# EasyEDA schematic Pc z80_senza arduino.json
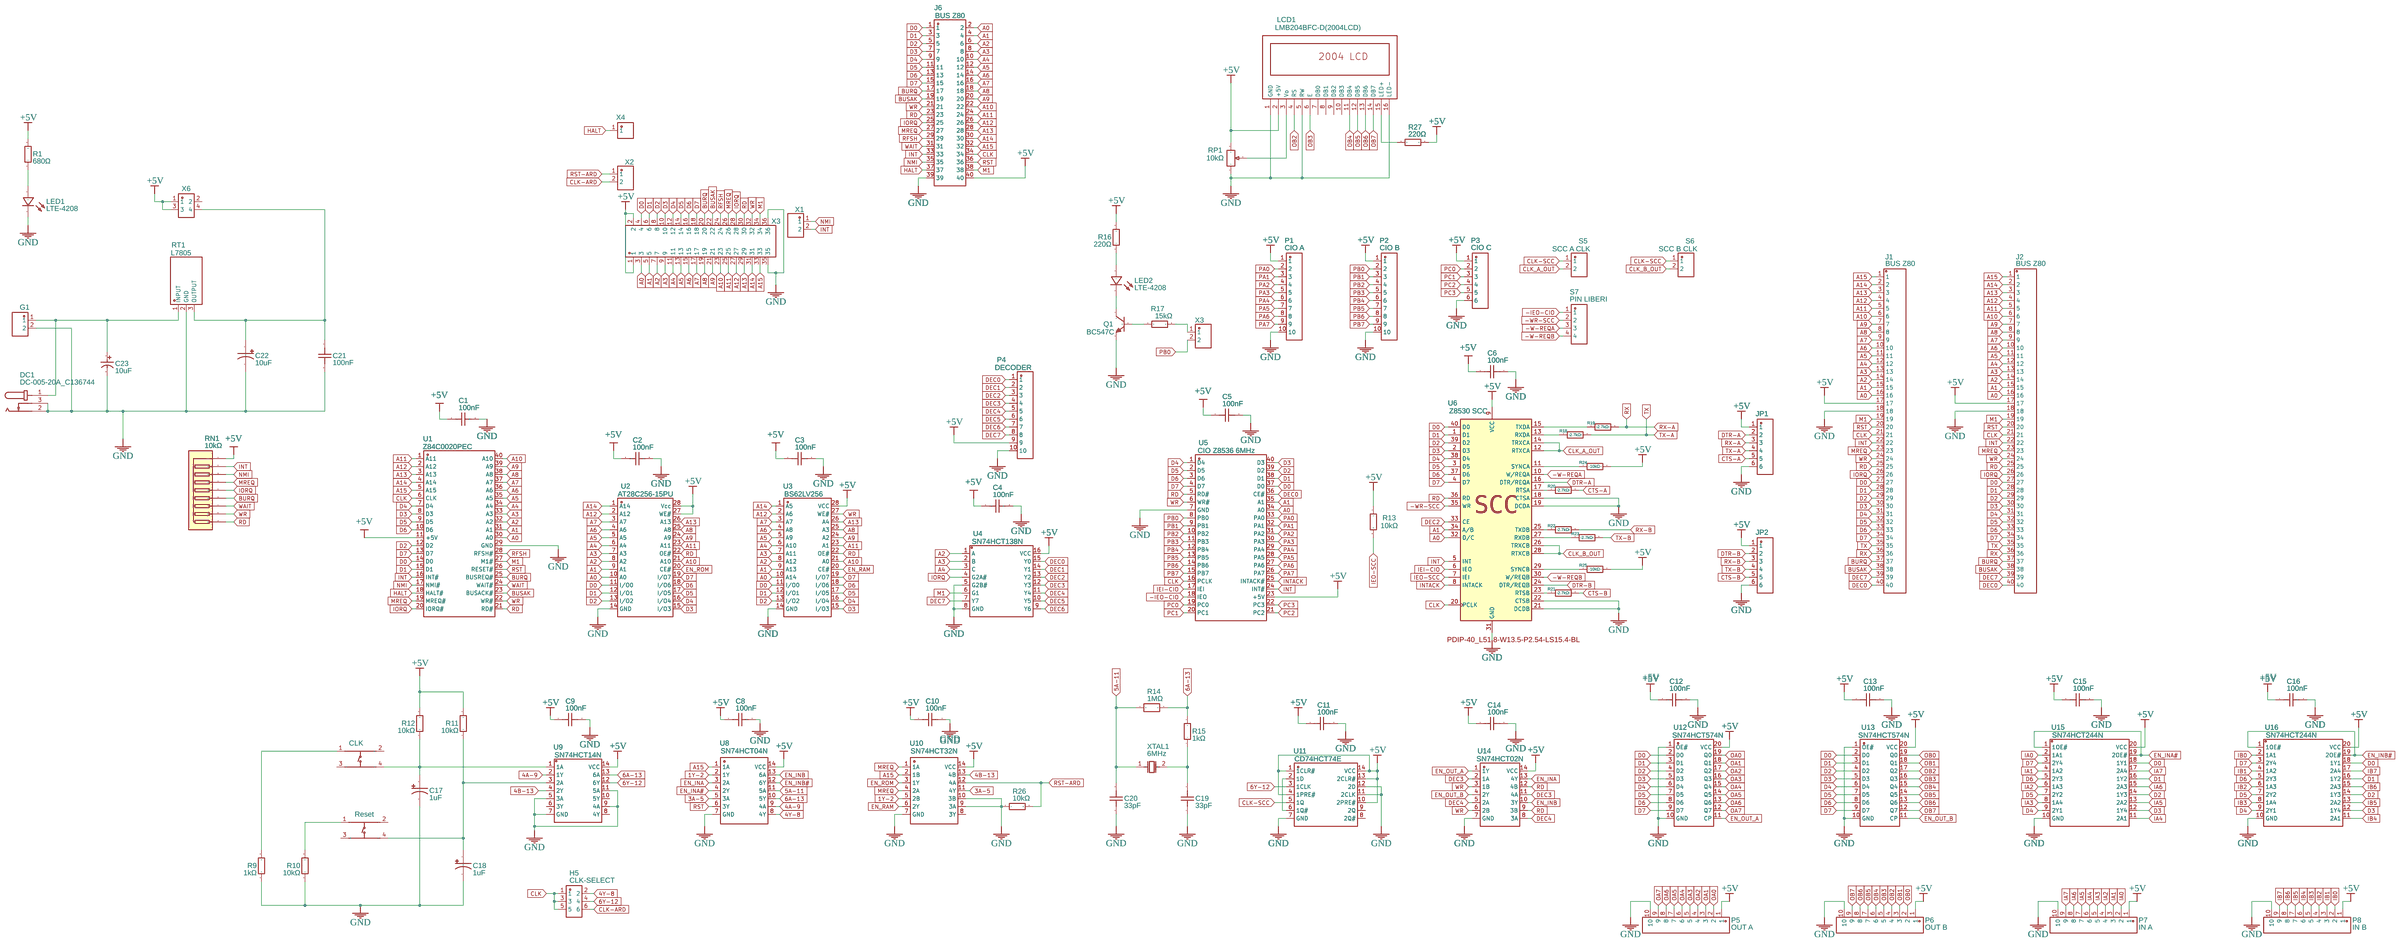
[diagram p0: schematic sheet]

## Parts
C1  100nF  [CAP-TH_L7.5-W2.5-P5.00-D0.5]
C2  100nF  [CAP-TH_L7.5-W2.5-P5.00-D0.5]
C3  100nF  [CAP-TH_L7.5-W2.5-P5.00-D0.5]
C4  100nF  [CAP-TH_L7.5-W2.5-P5.00-D0.5]
C5  100nF  [CAP-TH_L7.5-W2.5-P5.00-D0.5]
C6  100nF  [CAP-TH_L7.5-W2.5-P5.00-D0.5]
C8  100nF  [CAP-TH_L7.5-W2.5-P5.00-D0.5]
C9  100nF  [CAP-TH_L7.5-W2.5-P5.00-D0.5]
C10  100nF  [CAP-TH_L7.5-W2.5-P5.00-D0.5]
C11  100nF  [CAP-TH_L7.5-W2.5-P5.00-D0.5]
C12  100nF  [CAP-TH_L7.5-W2.5-P5.00-D0.5]
C13  100nF  [CAP-TH_L7.5-W2.5-P5.00-D0.5]
C14  100nF  [CAP-TH_L7.5-W2.5-P5.00-D0.5]
C15  100nF  [CAP-TH_L7.5-W2.5-P5.00-D0.5]
C16  100nF  [CAP-TH_L7.5-W2.5-P5.00-D0.5]
C17  1uF  [CAP-TH_BD5.0-P2.00-D0.8-FD]
C18  1uF  [CAP-TH_BD5.0-P2.00-D0.8-FD]
C19  33pF  [RCL-TH_L4.0-W2.6-LS2.5]
C20  33pF  [RCL-TH_L4.0-W2.6-LS2.5]
C21  100nF  [CAP-TH_L7.5-W2.5-P5.00-D0.5]
C22  10uF  [CAP-TH_BD4.0-P1.50-D0.5-FD]
C23  10uF  [CAP-TH_BD5.0-P2.00-D0.8-FD]
DC1  DC-005-20A_C136744  [DC-IN-TH_DC-005-20A]
H2  X3  [HDR-TH_36P-P2.54-V-M-R2-C18-S2.54]
H3  X1  [HDR-TH_2P-P2.54-V-M]
H4  X2  [HDR-TH_2P-P2.54-V-M]
H5  CLK-SELECT  [HDR-TH_6P-P2.54-V-M-R2-C3-S2.54]
H6  X3  [HDR-TH_2P-P2.54-V-M]
H7  JP1  [HDR-TH_6P-P2.54-V-F]
H8  JP2  [HDR-TH_6P-P2.54-V-F]
J1  BUS Z80  [HDR-TH_40P-P2.54-V-F]
J2  BUS Z80  [HDR-TH_40P-P2.54-V-F]
J6  BUS Z80  [HDR-TH_40P-P2.54-V-M-R2-C20-S2.54]
LCD1  LMB204BFC-D(2004LCD)  [LCD2004]
LED1  LTE-4208  [LED-TH_BD5.8-P2.54-FD]
LED2  LTE-4208  [LED-TH_BD5.8-P2.54-FD]
P1  CIO A  [HDR-TH_10P-P2.54-V-F]
P2  CIO B  [HDR-TH_10P-P2.54-V-F]
P3  CIO C  [HDR-TH_6P-P2.54-V-F]
P4  DECODER  [HDR-TH_10P-P2.54-V-F]
P5  OUT A  [HDR-TH_10P-P2.54-V-F]
P6  OUT B  [HDR-TH_10P-P2.54-V-F]
P7  IN A  [HDR-TH_10P-P2.54-V-F]
P8  IN B  [HDR-TH_10P-P2.54-V-F]
Q1  BC547C  [TO-92-3_L4.9-W3.7-P1.27-L]
R1  680Ω  [RES-TH_BD2.2-L6.5-P10.50-D0.6]
R9  1kΩ  [RES-TH_BD2.3-L6.5-P10.50-D0.5]
R10  10kΩ  [RES-TH_BD2.3-L6.5-P10.50-D0.5]
R11  10kΩ  [RES-TH_BD2.3-L6.5-P10.50-D0.5]
R12  10kΩ  [RES-TH_BD2.3-L6.5-P10.50-D0.5]
R13  10kΩ  [RES-TH_BD2.3-L6.5-P10.50-D0.5]
R14  1MΩ  [RES-TH_BD2.7-L6.2-P10.20-D0.4]
R15  1kΩ  [RES-TH_BD2.5-L6.5-P10.50-D0.6]
R16  220Ω  [RES-TH_BD2.3-L6.5-P10.50-D0.5]
R17  15kΩ  [RES-TH_BD2.3-L6.5-P10.50-D0.5]
R18  2.7kΩ  [RES-TH_BD2.3-L6.5-P10.50-D0.5]
R19  2.7kΩ  [RES-TH_BD2.3-L6.5-P10.50-D0.5]
R20  2.7kΩ  [RES-TH_BD2.3-L6.5-P10.50-D0.5]
R21  2.7kΩ  [RES-TH_BD2.3-L6.5-P10.50-D0.5]
R22  2.7kΩ  [RES-TH_BD2.3-L6.5-P10.50-D0.5]
R23  2.7kΩ  [RES-TH_BD2.3-L6.5-P10.50-D0.5]
R24  10kΩ  [RES-TH_BD2.3-L6.5-P10.50-D0.5]
R25  10kΩ  [RES-TH_BD2.3-L6.5-P10.50-D0.5]
R26  10kΩ  [RES-TH_BD2.5-L6.5-P10.50-D0.6]
R27  220Ω  [RES-TH_BD2.7-L6.2-P10.20-D0.4]
RN1  10kΩ  [RES-ARRAY-TH_9P-P2.54-D1.0]
RP1  10kΩ  [RES-ADJ-TH_3P-L7.1-W6.9-P2.50-L_3362P]
RT1  L7805  [TO-220-3_L10.0-W4.5-P2.54-L]
S5  SCC A CLK  [HDR-TH_2P-P2.54-V-F]
S6  SCC B CLK  [HDR-TH_2P-P2.54-V-F]
S7  PIN LIBERI  [HDR-TH_4P-P2.54-V-F]
SW1  Reset  [SW-TH_4P-L6.0-W6.0-P4.50-LS6.5]
SW4  CLK  [SW-TH_4P-L6.0-W6.0-P4.50-LS6.5]
U1  Z84C0020PEC  [PDIP-40_L52.3-W13.7-P2.54-LS15.5-BL]
U2  AT28C256-15PU  [PDIP-28_L37.0-W13.5-P2.54-LS15.6-BL]
U3  BS62LV256  [CDIP-28_L37.8-W15.4-P2.54-LS15.2-BL]
U4  SN74HCT138N  [DIP-16_L19.2-W6.6-P2.54-LS7.6-BL]
U5  CIO Z8536 6MHz  [PDIP-40_L52.3-W13.8-P2.54-LS15.2-BL]
U6  Z8530 SCC  [PDIP-40_L51.8-W13.5-P2.54-LS15.4-BL]
U8  SN74HCT04N  [PDIP-14_L19.3-W6.4-P2.54-LS7.9-BL-1]
U9  SN74HCT14N  [PDIP-14_L19.7-W6.6-P2.54-LS8.3-BL]
U10  SN74HCT32N  [PDIP-14_L19.3-W6.4-P2.54-LS8.0-BL]
U11  CD74HCT74E  [PDIP-14_L19.7-W6.6-P2.54-LS8.3-BL]
U12  SN74HCT574N  [PDIP-20_L25.9-W6.6-P2.54-LS7.9-BL]
U13  SN74HCT574N  [PDIP-20_L25.9-W6.6-P2.54-LS7.9-BL]
U14  SN74HCT02N  [DIP-14_L19.6-W6.4-P2.54-LS7.6-BL]
U15  SN74HCT244N  [DIP-20_L25.5-W10.0-P2.54-LS7.6-BL]
U16  SN74HCT244N  [DIP-20_L25.5-W10.0-P2.54-LS7.6-BL]
X4  X4  [HDR-TH_1P-V-F-1]
X5  G1  [HDR-TH_2P-P2.54-V-M]
X6  X6  [HDR-TH_4P-P2.54-V-M-R2-C2-S2.54]
XTAL1  6MHz  [HC-49US_L11.0-W4.6-P4.88]

## Library data of the parts
C1-C6 C8-C16 C21 = 82CL0113: Supplier: LCSC; Supplier Part: C5359294; Manufacturer: KNSCHA(科尼盛); Contributor: lcsc
C17 C18 = RC050M1R0LO5*11TH-2A1E: Contributor: LCSC; Supplier: LCSC; Supplier Part: C357595; Manufacturer: BERYL(绿宝石); JLCPCB Part Class: Extended Part
C19 C20 = K330J15C0GF5TL2: Supplier: LCSC; Supplier Part: C2170185; Manufacturer: VISHAY(威世); Contributor: lcsc; JLCPCB Part Class: Extended Part
C22 = 6.3MS510MEFCTZ4X5: Contributor: lcsc; Supplier: LCSC; Supplier Part: C5115397; Manufacturer: rubycon(红宝石); JLCPCB Part Class: Extended Part
C23 = 10uF 16V 5*11: Supplier: LCSC; Manufacturer: CX(承兴); Manufacturer Part: KM106M016D11RR0VH2FP0; Supplier Part: C43799; JLCPCB Part Class: Extended Part
DC1 = DC-005-20A_C136744: Contributor: LCSC; Supplier: LCSC; Manufacturer: 韩国韩荣; Manufacturer Part: DC-005-20A; Supplier Part: C136744; JLCPCB Part Class: Extended Part
H2 = PZ254-2-18-Z-8.5: Contributor: LCSC; Supplier: LCSC; Supplier Part: C2894979; Manufacturer: HCTL(华灿天禄); JLCPCB Part Class: Extended Part
H3 H4 H6 = PZ254V-11-02P: Contributor: LCSC; Supplier: LCSC; Supplier Part: C492401; Manufacturer: XFCN(兴飞); JLCPCB Part Class: Extended Part
H5 = PZ254V-12-6P: Contributor: LCSC; Supplier: LCSC; Supplier Part: C492420; Manufacturer: XFCN(兴飞); JLCPCB Part Class: Extended Part
H7 H8 = PM254V-11-06-H85: Contributor: LCSC; Supplier: LCSC; Supplier Part: C2832269; Manufacturer: XFCN(兴飞); JLCPCB Part Class: Extended Part
J1 J2 = 2.54MM1*40HEIGHT5.7MM: Contributor: LCSC; Supplier: LCSC; Manufacturer: BOOMELE(博穆精密); Manufacturer Part: 2.54-1*40P母高5.7; Supplier Part: C47940; JLCPCB Part Class: Extended Part
J6 = PZ2.54-2*20: Supplier: LCSC; Supplier Part: C5224014; Manufacturer: ZHOURI(洲日); JLCPCB Part Class: Extended Part; Contributor: lcsc
LCD1 = LMB204BFC-D(2004LCD): Manufacturer: TOPWAY; link: https://www.devicemart.co.kr/goods/view?no=19049; Contributor: edsonwoodworking
LED1 LED2 = LTE-4208: Supplier: LCSC; Supplier Part: C5346733; Manufacturer: LITEON(光宝); JLCPCB Part Class: Extended Part; Contributor: lcsc
P1 P2 P4-P8 = PM2.54-1*10: Contributor: lcsc; Supplier: LCSC; Supplier Part: C5116489; Manufacturer: ZHOURI(洲日); JLCPCB Part Class: Extended Part
P3 = Header-Female-2.54_1x6: Supplier: LCSC; Manufacturer: BOOMELE(博穆精密); Manufacturer Part: 2.54-1*6P母; Supplier Part: C40877; JLCPCB Part Class: Extended Part
Q1 = BC547C: Contributor: LCSC; Supplier: LCSC; Supplier Part: C713614; Manufacturer: LGE(鲁光); JLCPCB Part Class: Extended Part
R1 = CF1/4W-680Ω±5% T52: Supplier: LCSC; Manufacturer: CCO(千志电子); Manufacturer Part: CF1/4W-680Ω±5% T; Supplier Part: C120051; JLCPCB Part Class: Extended Part
R9-R13 R16-R25 = CF1/4W-1KΩ±5% T52: Contributor: LCSC; Supplier: LCSC; Supplier Part: C120055; Manufacturer: CCO(千志电子); Manufacturer Part: CF1/4W-1KΩ±5% T; JLCPCB Part Class: Extended Part
R14 = MF1/4W-1M±1%-OT52: Contributor: lcsc; Supplier: LCSC; Supplier Part: C2903250; Manufacturer: VO(翔胜); JLCPCB Part Class: Extended Part
R15 = MO1/2WS-220K±5%-ST52: Contributor: LCSC; Supplier: LCSC; Supplier Part: C479385; Manufacturer: VO(翔胜); JLCPCB Part Class: Extended Part; link: https://lcsc.com/eda_search?q=C479385&%26type=1&ref=editor
R26 = MO1/2WS-220K±5%-ST52: Contributor: LCSC; Supplier: LCSC; Supplier Part: C479385; Manufacturer: VO(翔胜); JLCPCB Part Class: Extended Part
R27 = MF1/4W-100K±1%-OT26: Contributor: lcsc; Supplier: LCSC; Supplier Part: C2843019; Manufacturer: VO(翔胜); JLCPCB Part Class: Extended Part
RN1 = A09-103JP: Supplier: LCSC; Manufacturer: FH(风华); Supplier Part: C8692; JLCPCB Part Class: Extended Part
RP1 = 3362P-1-202_C118929: Resistance(Ohms): 2K; Contributor: LCSC; Supplier: LCSC; Supplier Part: C118929; Manufacturer: BOCHEN(博晨); Manufacturer Part: 3362P-1-202; JLCPCB Part Class: Extended Part
RT1 = L7805_C22378639: Supplier: LCSC; Supplier Part: C22378639; Manufacturer: OSEN(欧芯); JLCPCB Part Class: Extended Part; Contributor: lcsc
S5 S6 = ZX-PM2.54-1-2PY: Supplier: LCSC; Supplier Part: C7499322; Manufacturer: Megastar(兆星); Contributor: lcsc; JLCPCB Part Class: Extended Part
S7 = 2.54-1*4P母: Contributor: LCSC; Supplier: LCSC; Supplier Part: C2718488; Manufacturer: BOOMELE(博穆精密); JLCPCB Part Class: Extended Part
SW1 SW4 = TS665CJ: Contributor: LCSC; Supplier: LCSC; Supplier Part: C393938; Manufacturer: SHOU HAN(首韩); JLCPCB Part Class: Extended Part
U1 = Z84C0008PEG: Supplier: LCSC; Supplier Part: C3231800; Manufacturer: Zilog; JLCPCB Part Class: Extended Part; Contributor: lcsc
U2 = AT28C256-15PU: Contributor: LCSC; Supplier: LCSC; Supplier Part: C1348752; Manufacturer: MICROCHIP(美国微芯); JLCPCB Part Class: Extended Part
U3 = CY62256NL-70PC: Contributor: lcsc; Supplier: LCSC; Supplier Part: C2956434; Manufacturer: Infineon/CYPRESS(赛普拉斯); JLCPCB Part Class: Extended Part
U4 = SN74HCT138N: Contributor: LCSC; Supplier: LCSC; Supplier Part: C67461; Manufacturer: TI(德州仪器); JLCPCB Part Class: Extended Part
U5 = Z0853606PSG: Contributor: LCSC; Supplier: LCSC; Supplier Part: C2614526; Manufacturer: Zilog; JLCPCB Part Class: Extended Part
U6 = Z8530-RESCUE-SERIALIO: Contributor: ZORAk; Package Display: Yes
U8 = SN74HCT04N: Contributor: LCSC; Supplier: LCSC; Manufacturer: TI(德州仪器); Supplier Part: C50939; JLCPCB Part Class: Extended Part
U9 = SN74HCT14N: Contributor: LCSC; Supplier: LCSC; Supplier Part: C352959; Manufacturer: TI(德州仪器); JLCPCB Part Class: Extended Part
U10 = SN74HCT32N: Contributor: LCSC; Supplier: LCSC; Supplier Part: C2869289; Manufacturer: TI(德州仪器); JLCPCB Part Class: Extended Part
U11 = CD74HCT74E: Contributor: LCSC; Supplier: LCSC; Supplier Part: C1523192; Manufacturer: TI(德州仪器); JLCPCB Part Class: Extended Part
U12 U13 = SN74HCT574N: Contributor: LCSC; Supplier: LCSC; Supplier Part: C1523201; Manufacturer: TI(德州仪器); JLCPCB Part Class: Extended Part
U14 = SN74HCT02N: Supplier: LCSC; Supplier Part: C354417; Manufacturer: TI(德州仪器); JLCPCB Part Class: Extended Part; Contributor: lcsc
U15 U16 = SN74HCT244N: Contributor: LCSC; Supplier: LCSC; Supplier Part: C347587; Manufacturer: TI(德州仪器); JLCPCB Part Class: Extended Part
X4 = X5511FV-01-C30D97-0970: Contributor: LCSC; Supplier: LCSC; Supplier Part: C2883469; Manufacturer: XKB Connectivity(中国星坤); JLCPCB Part Class: Extended Part
X5 = ZX-PZ2.54-1-2PZZ: Supplier: LCSC; Supplier Part: C7501260; Manufacturer: Megastar(兆星); Contributor: lcsc; JLCPCB Part Class: Extended Part
X6 = PZ254V-12-4P: Contributor: LCSC; Supplier: LCSC; Supplier Part: C492419; Manufacturer: XFCN(兴飞); JLCPCB Part Class: Extended Part
XTAL1 = ECS-60-32-4X: Contributor: lcsc; Supplier: LCSC; Supplier Part: C2636154; Manufacturer: ECS

## Nets
+5V: C1.1 C2.1 C3.1 C4.1 C5.1 C6.1 C8.1 C9.1 C10.1 C11.1 C12.1 C13.1 C14.1 C15.1 C16.1 H2.1 H2.2 H7.1 H8.1 J1.17 J2.17 J6.40 LCD1.2(+5V) P1.1 P2.1 P3.1 P4.9 P5.1 P6.1 P7.1 P8.1 R1.2 R11.2 R12.2 R13.1 R16.2 R24.2 R25.2 R27.2 RN1.1 RP1.3 U1.11(+5V) U2.27(WE#) U2.28(Vcc) U3.28(VCC) U4.16(VCC) U5.23(+5V) U6.9(VCC) U8.14(VCC) U9.14(VCC) U10.14(VCC) U11.1(1CLR#) U11.4(1PRE#) U11.10(2PRE#) U11.13(2CLR#) U11.14(VCC) U12.20(VCC) U13.20(VCC) U14.14(VCC) U15.20(VCC) U16.20(VCC) X6.1 X6.3
GND: C1.2 C2.2 C3.2 C4.2 C5.2 C6.2 C8.2 C9.2 C10.2 C11.2 C12.2 C13.2 C14.2 C15.2 C16.2 C17.2 C18.2 C19.1 C20.1 C21.2 C22.2 C23.2 DC1.2 DC1.3 H2.35 H2.36 H7.6 H8.6 J1.18 J2.18 J6.39 LCD1.1(GND) LCD1.5(RW) LCD1.16(LED-) LED1.2 P1.10 P2.10 P3.6 P4.10 P5.10 P6.10 P7.10 P8.10 Q1.3(E) R9.1 R10.1 R26.1 RP1.1 RT1.2(GND) U1.29(GND) U2.14(GND) U3.14(GND) U4.5(G2B#) U4.8(GND) U5.7(GND) U6.18(CTSA) U6.19(DCDA) U6.21(DCDB) U6.22(CTSB) U6.31(GND) U8.7(GND) U9.5(3A) U9.7(GND) U9.9(4A) U9.11(5A) U10.7(GND) U10.9(3A) U10.10(3B) U11.7(GND) U11.11(2CLK) U11.12(2D) U12.1(OE#) U12.10(GND) U13.1(OE#) U13.10(GND) U14.7(GND) U15.10(GND) U16.10(GND) X5.2
1Y-2: U8.2(1Y) U10.5(2B)
3A-5: U8.5(3A) U10.11(4Y)
4A-9: U8.9(4A) U9.2(1Y)
4B-13: U9.4(2Y) U10.13(4B)
4Y-8: H5.2 U8.8(4Y)
5A-11: C20.2 R14.1 U8.11(5A) XTAL1.1(OSC1)
6A-13: R14.2 R15.2 U8.10(5Y) U9.13(6A)
6Y-12: H5.4 U9.12(6Y) U11.3(1CLK)
-IEO-CIO: S7.1 U5.18(IEO)
-W-REQA: S7.3 U6.10(W/REQA)
-W-REQB: S7.4 U6.30(W/REQB)
-WR-SCC: S7.2 U6.35(WR)
A0: H2.3 J1.16 J2.16 J6.2 U1.30(A0) U2.10(A0) U3.10(A14) U5.34(A0) U6.32(D/C)
A1: H2.5 J1.15 J2.15 J6.4 U1.31(A1) U2.9(A1) U3.9(A13) U5.35(A1) U6.34(A/B)
A2: H2.7 J1.14 J2.14 J6.6 U1.32(A2) U2.8(A2) U3.8(A12) U4.1(A)
A3: H2.9 J1.13 J2.13 J6.8 U1.33(A3) U2.7(A3) U3.7(A11) U4.2(B)
A4: H2.11 J1.12 J2.12 J6.10 U1.34(A4) U2.6(A4) U3.6(A10) U4.3(C)
A5: H2.13 J1.11 J2.11 J6.12 U1.35(A5) U2.5(A5) U3.5(A9)
A6: H2.15 J1.10 J2.10 J6.14 U1.36(A6) U2.4(A6) U3.4(A8)
A7: H2.17 J1.9 J2.9 J6.16 U1.37(A7) U2.3(A7) U3.3(A7)
A8: H2.19 J1.8 J2.8 J6.18 U1.38(A8) U2.25(A8) U3.25(A3)
A9: H2.21 J1.7 J2.7 J6.20 U1.39(A9) U2.24(A9) U3.24(A2)
A10: H2.23 J1.6 J2.6 J6.22 U1.40(A10) U2.21(A10) U3.21(A0)
A11: H2.25 J1.5 J2.5 J6.24 U1.1(A11) U2.23(A11) U3.23(A1)
A12: H2.27 J1.4 J2.4 J6.26 U1.2(A12) U2.2(A12) U3.2(A6)
A13: H2.29 J1.3 J2.3 J6.28 U1.3(A13) U2.26(A13) U3.26(A4)
A14: H2.31 J1.2 J2.2 J6.30 U1.4(A14) U2.1(A14) U3.1(A5)
A15: H2.33 J1.1 J2.1 J6.32 U1.5(A15) U8.1(1A) U10.2(1B)
BURQ: H2.20 J1.37 J2.37 J6.17 RN1.6 U1.25(BUSREQ#)
BUSAK: H2.22 J1.38 J2.38 J6.19 U1.23(BUSACK#)
CLK: H5.1 H5.3 H5.5 J1.21 J2.21 J6.34 U1.6(CLK) U5.16(PCLK) U6.20(PCLK)
CLK-ARD: H4.2 H5.6
CLK-SCC: S5.1 S6.1 U11.5(1Q)
CLK_A_OUT: S5.2 U6.12(RTXCA) U6.14(TRXCA)
CLK_B_OUT: S6.2 U6.26(TRXCB) U6.28(RTXCB)
CTS-A: H7.5 R20.2
CTS-B: H8.5 R21.2
D0: H2.4 J1.27 J2.27 J6.1 U1.14(D0) U2.11(I/O0) U3.11(I/O0) U5.37(D0) U6.40(D0) U12.2(D0) U13.2(D0) U15.18(1Y1) U16.18(1Y1)
D1: H2.6 J1.28 J2.28 J6.3 U1.15(D1) U2.12(I/O1) U3.12(I/O1) U5.38(D1) U6.1(D1) U12.3(D1) U13.3(D1) U15.16(1Y2) U16.16(1Y2)
D2: H2.8 J1.29 J2.29 J6.5 U1.12(D2) U2.13(I/O2) U3.13(I/O2) U5.39(D2) U6.39(D2) U12.4(D2) U13.4(D2) U15.14(1Y3) U16.14(1Y3)
D3: H2.10 J1.30 J2.30 J6.7 U1.8(D3) U2.15(I/O3) U3.15(I/O3) U5.40(D3) U6.2(D3) U12.5(D3) U13.5(D3) U15.12(1Y4) U16.12(1Y4)
D4: H2.12 J1.31 J2.31 J6.9 U1.7(D4) U2.16(I/O4) U3.16(I/O4) U5.1(D4) U6.38(D4) U12.6(D4) U13.6(D4) U15.9(2Y1) U16.9(2Y1)
D5: H2.14 J1.32 J2.32 J6.11 U1.9(D5) U2.17(I/O5) U3.17(I/O5) U5.2(D5) U6.3(D5) U12.7(D5) U13.7(D5) U15.7(2Y2) U16.7(2Y2)
D6: H2.16 J1.33 J2.33 J6.13 U1.10(D6) U2.18(I/O6) U3.18(I/O6) U5.3(D6) U6.37(D6) U12.8(D6) U13.8(D6) U15.5(2Y3) U16.5(2Y3)
D7: H2.18 J1.34 J2.34 J6.15 U1.13(D7) U2.19(I/O7) U3.19(I/O7) U5.4(D7) U6.4(D7) U12.9(D7) U13.9(D7) U15.3(2Y4) U16.3(2Y4)
DEC0: J1.40 J2.40 P4.1 U4.15(Y0) U5.36(CE#)
DEC1: P4.2 U4.14(Y1)
DEC2: P4.3 U4.13(Y2) U6.33(CE)
DEC3: P4.4 U4.12(Y3) U14.2(1A) U14.11(4A)
DEC4: P4.5 U4.11(Y4) U14.5(2A) U14.8(3A)
DEC5: P4.6 U4.10(Y5)
DEC6: P4.7 U4.9(Y6)
DEC7: J1.39 J2.39 P4.8 U4.7(Y7)
DTR-A: H7.2 U6.16(DTR/REQA)
DTR-B: H8.2 U6.24(DTR/REQB)
EN_INA: U8.3(2A) U14.13(4Y)
EN_INA#: U8.4(2Y) U15.1(1OE#) U15.19(2OE#)
EN_INB: U8.13(6A) U14.10(3Y)
EN_INB#: U8.12(6Y) U16.1(1OE#) U16.19(2OE#)
EN_OUT_A: U12.11(CP) U14.1(1Y)
EN_OUT_B: U13.11(CP) U14.4(2Y)
EN_RAM: U3.20(CE#) U10.6(2Y)
EN_ROM: U2.20(CE#) U10.3(1Y)
HALT: J6.37 U1.18(HALT#) X4.1
IA0: P7.2 U15.2(1A1)
IA1: P7.3 U15.4(1A2)
IA2: P7.4 U15.6(1A3)
IA3: P7.5 U15.8(1A4)
IA4: P7.6 U15.11(2A1)
IA5: P7.7 U15.13(2A2)
IA6: P7.8 U15.15(2A3)
IA7: P7.9 U15.17(2A4)
IB0: P8.2 U16.2(1A1)
IB1: P8.3 U16.4(1A2)
IB2: P8.4 U16.6(1A3)
IB3: P8.5 U16.8(1A4)
IB4: P8.6 U16.11(2A1)
IB5: P8.7 U16.13(2A2)
IB6: P8.8 U16.15(2A3)
IB7: P8.9 U16.17(2A4)
IEI-CIO: U5.17(IEI) U6.6(IEO)
IEO-SCC: R13.2 U6.7(IEI)
INT: H3.2 J1.22 J2.22 J6.33 RN1.2 U1.16(INT#) U5.24(INT#) U6.5(INT)
INTACK: U5.25(INTACK#) U6.8(INTACK)
IORQ: H2.28 J1.26 J2.26 J6.25 RN1.5 U1.20(IORQ#) U4.4(G2A#)
M1: H2.34 J1.19 J2.19 J6.38 U1.27(M1#) U4.6(G1)
MREQ: H2.26 J1.23 J2.23 J6.27 RN1.4 U1.19(MREQ#) U10.1(1A) U10.4(2A)
NMI: H3.1 J6.35 RN1.3 U1.17(NMI#)
OA0: P5.2 U12.19(Q0)
OA1: P5.3 U12.18(Q1)
OA2: P5.4 U12.17(Q2)
OA3: P5.5 U12.16(Q3)
OA4: P5.6 U12.15(Q4)
OA5: P5.7 U12.14(Q5)
OA6: P5.8 U12.13(Q6)
OA7: P5.9 U12.12(Q7)
OB0: P6.2 U13.19(Q0)
OB1: P6.3 U13.18(Q1)
OB2: LCD1.4(RS) P6.4 U13.17(Q2)
OB3: LCD1.6(E) P6.5 U13.16(Q3)
OB4: LCD1.11(DB4) P6.6 U13.15(Q4)
OB5: LCD1.12(DB5) P6.7 U13.14(Q5)
OB6: LCD1.13(DB6) P6.8 U13.13(Q6)
OB7: LCD1.14(DB7) P6.9 U13.12(Q7)
PA0: P1.2 U5.33(PA0)
PA1: P1.3 U5.32(PA1)
PA2: P1.4 U5.31(PA2)
PA3: P1.5 U5.30(PA3)
PA4: P1.6 U5.29(PA4)
PA5: P1.7 U5.28(PA5)
PA6: P1.8 U5.27(PA6)
PA7: P1.9 U5.26(PA7)
PB0: H6.2 P2.2 U5.8(PB0)
PB1: P2.3 U5.9(PB1)
PB2: P2.4 U5.10(PB2)
PB3: P2.5 U5.11(PB3)
PB4: P2.6 U5.12(PB4)
PB5: P2.7 U5.13(PB5)
PB6: P2.8 U5.14(PB6)
PB7: P2.9 U5.15(PB7)
PC0: P3.2 U5.19(PC0)
PC1: P3.3 U5.20(PC1)
PC2: P3.4 U5.21(PC2)
PC3: P3.5 U5.22(PC3)
RD: H2.30 J1.25 J2.25 J6.23 RN1.9 U1.21(RD#) U2.22(OE#) U3.22(OE#) U5.5(RD#) U6.36(RD) U14.9(3B) U14.12(4B)
RFSH: H2.24 J6.29 U1.28(RFSH#)
RST: J1.20 J2.20 J6.36 U1.26(RESET#) U8.6(3Y)
RST-ARD: H4.1 R26.2 U10.12(4A)
RX: H7.3 J1.36 J2.36 R19.2
RX-B: H8.3 R22.2
TX: H7.4 J1.35 J2.35 R18.2
TX-B: H8.4 R23.2
WAIT: J6.31 RN1.7 U1.24(WAIT#)
WR: H2.32 J1.24 J2.24 J6.21 RN1.8 U1.22(WR#) U3.27(WE#) U5.6(WR#) U14.3(1B) U14.6(2B)
Net-(C17-1): C17.1 R12.1 SW4.4(D) U9.1(1A)
Net-(C18-1): C18.1 R11.1 SW1.4(D) U9.3(2A)
Net-(C19-2): C19.2 R15.1 XTAL1.2(OSC2)
Net-(C21-1): C21.1 C22.1 RT1.3(OUTPUT) X6.4
Net-(C23-1): C23.1 DC1.1 RT1.1(INPUT) X5.1
Net-(H6-1): H6.1 R17.2
Net-(LCD1-3): LCD1.3(Vo) RP1.2
Net-(LCD1-15): LCD1.15(LED+) R27.1
Net-(LED1-1): LED1.1 R1.1
Net-(LED2-1): LED2.1 R16.1
Net-(LED2-2): LED2.2 Q1.1(C)
Net-(Q1-2): Q1.2(B) R17.1
Net-(R9-2): R9.2 SW4.1(A)
Net-(R10-2): R10.2 SW1.1(A)
Net-(R18-1): R18.1 U6.13(RXDA)
Net-(R19-1): R19.1 U6.15(TXDA)
Net-(R20-1): R20.1 U6.17(RTSA)
Net-(R21-1): R21.1 U6.23(RTSB)
Net-(R22-1): R22.1 U6.25(TXDB)
Net-(R23-1): R23.1 U6.27(RXDB)
Net-(R24-1): R24.1 U6.11(SYNCA)
Net-(R25-1): R25.1 U6.29(SYNCB)
Net-(U11-2): U11.2(1D) U11.6(1Q#)

Not connected (* = marked no-connect by the designer): LCD1 7(DB0) 8(DB1) 9(DB2) 10(DB3); SW1 2(B) 3(C); SW4 2(B) 3(C); U9 6(3Y) 8(4Y) 10(5Y); U10 8(3Y); U11 8(2Q#) 9(2Q); X6 2

## Notes on the sheet
- +5V
- +5V
- GND
